# EAGLE design store-ctrl-block (EAGLE 7.3.0)
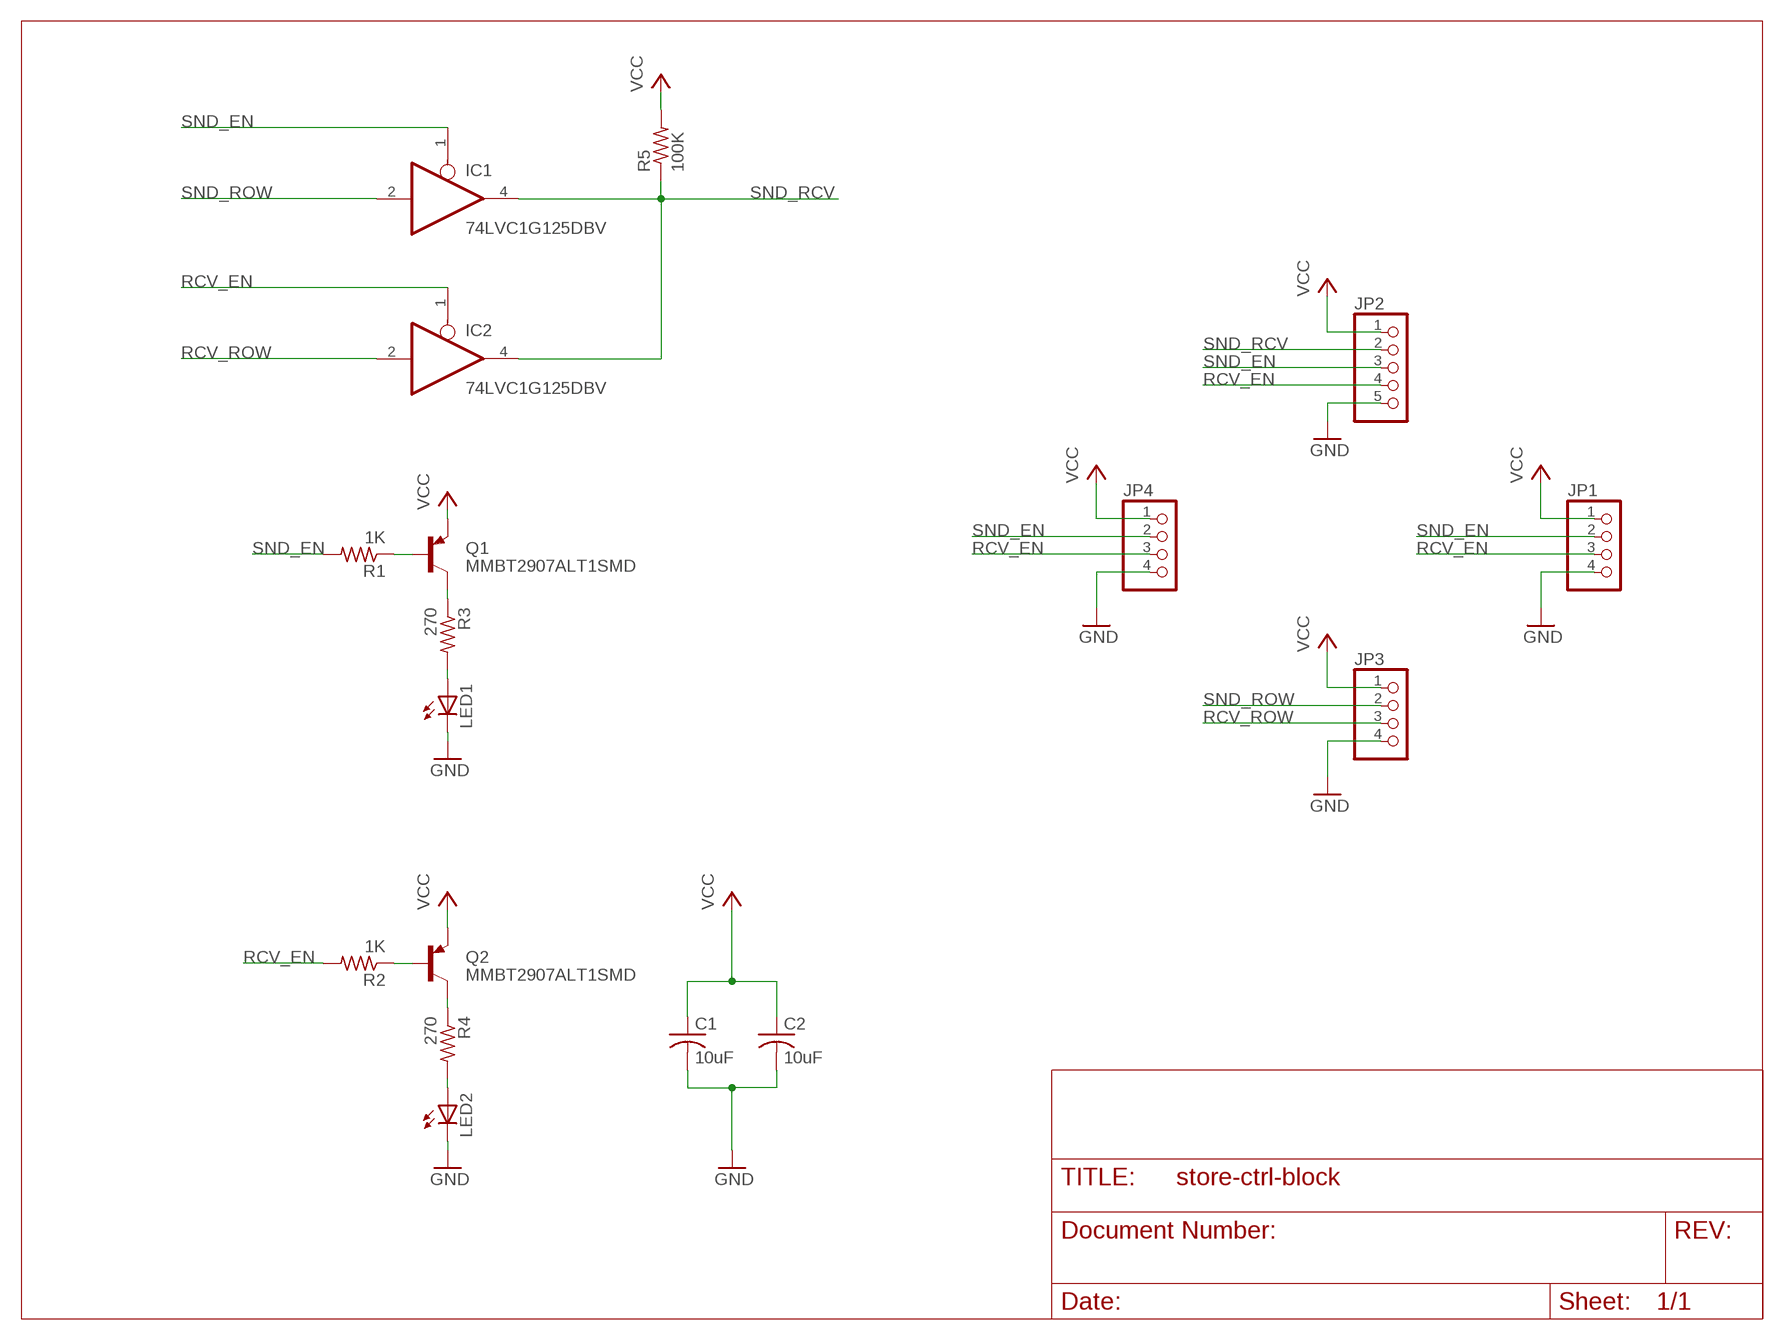
[diagram p0: schematic, sheet 1]

## Parts
C1  10uF  C-USC0805  [C0805]
C2  10uF  C-USC0805  [C0805]
IC1  74LVC1G125DBV  [SOT23-5]
IC2  74LVC1G125DBV  [SOT23-5]
JP1  PINHD-1X4  [1X04]
JP2  PINHD-1X5  [1X05]
JP3  PINHD-1X4  [1X04]
JP4  PINHD-1X4  [1X04]
LED1  LEDCHIP-LED0805  [CHIP-LED0805]
LED2  LEDCHIP-LED0805  [CHIP-LED0805]
Q1  MMBT2907ALT1SMD  [SOT23-BEC]
Q2  MMBT2907ALT1SMD  [SOT23-BEC]
R1  1K  R-US_R0805  [R0805]
R2  1K  R-US_R0805  [R0805]
R3  270  R-US_R0805  [R0805]
R4  270  R-US_R0805  [R0805]
R5  100K  R-US_R0805  [R0805]

## Nets
GND: C1.2 C2.2 JP1.4 JP2.5 JP3.4 JP4.4 LED1.C LED2.C
N$1: Q2.B R2.1
N$2: Q1.B R1.1
N$3: Q2.C R4.1
N$4: Q1.C R3.1
N$5: LED1.A R3.2
N$6: LED2.A R4.2
RCV_EN: IC2.1(OE) JP1.3 JP2.4 JP4.3 R2.2
RCV_ROW: IC2.2(I) JP3.3
SND_EN: IC1.1(OE) JP1.2 JP2.3 JP4.2 R1.2
SND_RCV: IC1.4(O) IC2.4(O) JP2.2 R5.1
SND_ROW: IC1.2(I) JP3.2
VCC: C1.1 C2.1 JP1.1 JP2.1 JP3.1 JP4.1 Q1.E Q2.E R5.2

## Power pins joined to a net without a drawn wire
GND: IC1.3(GND) IC2.3(GND)
VCC: IC1.5(VCC) IC2.5(VCC)

## Library data of the parts
C1 C2 = resistor:C-US: CAPACITOR, American symbol
IC1 IC2 = 74xx-little-us:74*1G125: Single Bus Buffer Gate with 3-State Output
JP1 JP3 JP4 = pinhead:PINHD-1X4: PIN HEADER
JP2 = pinhead:PINHD-1X5: PIN HEADER
LED1 LED2 = led:LED: LED OSRAM: - CHIPLED LG R971, LG N971, LY N971, LG Q971, LY Q971, LO R971, LY R971 LH N974, LH R974 LS Q976, LO Q976, LY Q976 LO Q996 - Hyper CHIPLED LW Q18S LB Q993, LB Q99A, LB R99A - SideLED LS A670, LO A670, LY A670, LG A670, LP A670 LB A673, LV A673, LT A673, LW A673 LH A674 LY A675 LS A676, LA A676, LO A676, LY A676, LW A676 LS A679, LY A679, LG A679 - Hyper Micro SIDELED® LS Y876, LA Y876, LO Y876, LY Y876 LT Y87S - SmartLED LW L88C, LW L88S LB L89C, LB L89S, LG L890 LS L89K, LO L89K, LY L89K LS L896, LA L896, LO L896, LY L896 - TOPLED LS T670, LO T670, LY T670, LG T670, LP T670 LSG T670, LSP T670, LSY T670, LOP T670, LYG T670 LG T671, LOG T671, LSG T671 LB T673, LV T673, LT T673, LW T673 LH T674 LS T676, LA T676, LO T676, LY T676, LB T676, LH T676, LSB T676, LW T676 LB T67C, LV T67C, LT T67C, LS T67K, LO T67K, LY T67K, LW E67C LS E67B, LA E67B, LO E67B, LY E67B, LB E67C, LV E67C, LT E67C LW T67C LS T679, LY T679, LG T679 LS T770, LO T770, LY T770, LG T770, LP T770 LB T773, LV T773, LT T773, LW T773 LH T774 LS E675, LA E675, LY E675, LS T675 LS T776, LA T776, LO T776, LY T776, LB T776 LHGB T686 LT T68C, LB T68C - Hyper Mini TOPLED® LB M676 - Mini TOPLED Santana® LG M470 LS M47K, LO M47K, LY M47K Source: http://www.osram.convergy.de LUXEON: - LUMILED® LXK2-PW12-R00, LXK2-PW12-S00, LXK2-PW14-U00, LXK2-PW14-V00 LXK2-PM12-R00, LXK2-PM12-S00, LXK2-PM14-U00 LXK2-PE12-Q00, LXK2-PE12-R00, LXK2-PE12-S00, LXK2-PE14-T00, LXK2-PE14-U00 LXK2-PB12-K00, LXK2-PB12-L00, LXK2-PB12-M00, LXK2-PB14-N00, LXK2-PB14-P00, LXK2-PB14-Q00 LXK2-PR12-L00, LXK2-PR12-M00, LXK2-PR14-Q00, LXK2-PR14-R00 LXK2-PD12-Q00, LXK2-PD12-R00, LXK2-PD12-S00 LXK2-PH12-R00, LXK2-PH12-S00 LXK2-PL12-P00, LXK2-PL12-Q00, LXK2-PL12-R00 Source: www.luxeon.com KINGBRIGHT: KA-3528ASYC Source: www.kingbright.com
Q1 Q2 = transistor-pnp:MMBT2907*: PNP Transistror
R1-R5 = resistor:R-US_: RESISTOR, American symbol

## Board
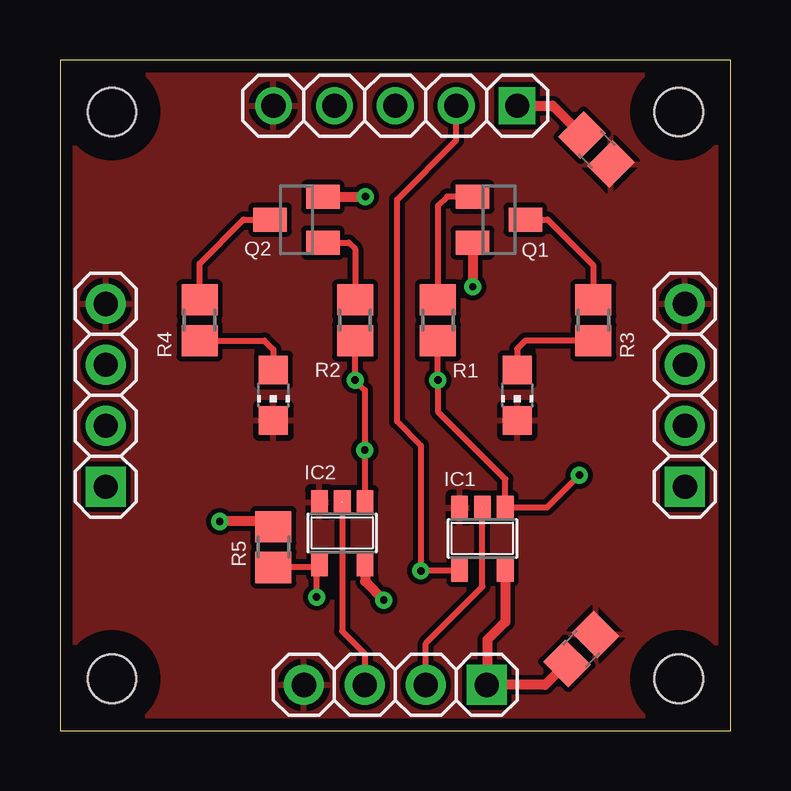
[diagram p1: board, top side]
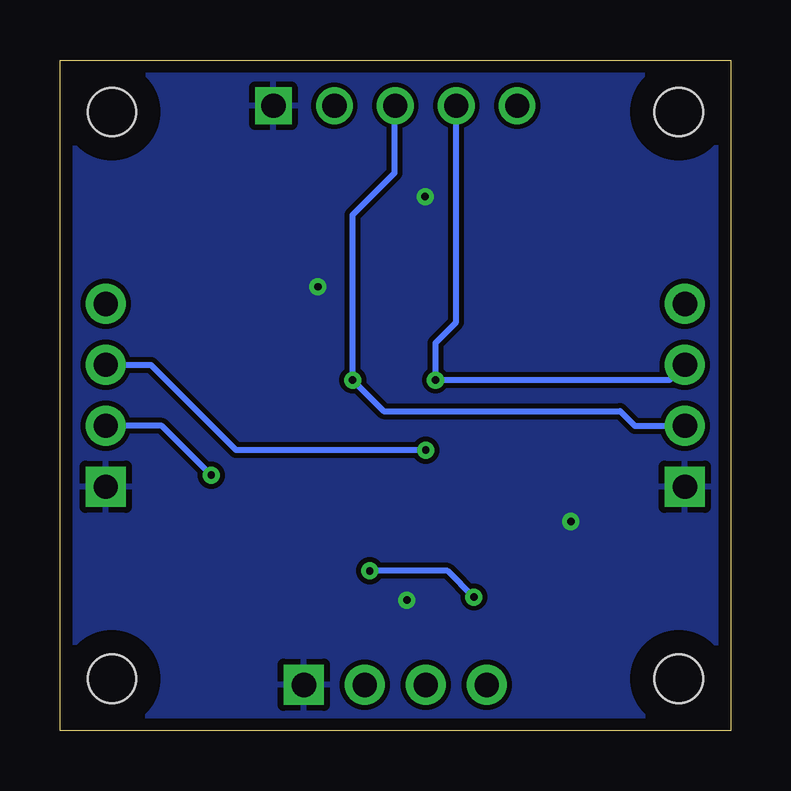
[diagram p2: board, bottom side, seen from below]

Size 27.94 x 27.94 mm. Coordinates in mm from the lower left corner, seen from the top.
Outline: 27.94,27.94 0,27.94 0,0 27.94,0 27.94,27.94
Copper layers (1*16): Top 0.035mm / dielectric 1.5mm / Bottom 0.035mm
Design rules "default *": minimum track width 8mil, minimum drill 12mil, track to track 8mil, track to pad 8mil, pad to pad 8mil, via to via 8mil, smd to smd 8mil, copper to edge 20mil, drill to drill 8mil, minimum pad ring 10mil, minimum via ring 8mil, stop-mask expansion 4mil, vias tented up to drill 0mil, thermal gap 10mil
Holes 2.01 mm at 2.16,2.16 25.78,2.16 25.78,25.78 2.16,25.78
tRestrict: area 23.8,0.2 to 27.8,4.2; area 23.8,23.8 to 27.8,27.8; area 0.2,23.8 to 4.2,27.8; area 0.2,0.2 to 4.2,4.2
bRestrict: area 23.8,0.2 to 27.8,4.2; area 23.8,23.8 to 27.8,27.8; area 0.2,23.8 to 4.2,27.8; area 0.2,0.2 to 4.2,4.2

### Footprints (pad centres in the part's own frame; a part is rotated, then mirrored left to right if it is on the bottom)
C0805 = smd 1.3 x 1.5: 1 -0.85,0; 2 0.85,0
SOT23-5 = smd 0.69 x 0.99: 1 -0.95,-1.29; 2 0,-1.29; 3 0.95,-1.29; 4 0.95,1.3; 5 -0.95,1.3
1X04 = drill 1.016 pad 1.676 square: 1 -3.81,0 | drill 1.016 pad 1.676: 2 -1.27,0; 3 1.27,0; 4 3.81,0
1X05 = drill 1.016 square: 1 -5.08,0 | drill 1.016: 2 -2.54,0; 3 0,0; 4 2.54,0; 5 5.08,0
CHIP-LED0805 = smd 1.2 x 1.2: A 0,-1.05; C 0,1.05
SOT23-BEC = smd 1 x 1.4: B -0.95,-1.1; C 0,1.1; E 0.95,-1.1
R0805 = smd 1.3 x 1.5: 1 -0.85,0; 2 0.85,0

### Placement (x,y rotation side)
C1  21.72,3.4 45 top
C2  22.35,24.21 315 top
IC1  17.6,8 180 top
IC2  11.76,8.23 180 top
JP1  26.04,13.97 90 top
JP2  13.97,26.04 180 top
JP3  13.97,1.91 180 top
JP4  1.91,13.97 90 top
LED1  19.05,13.97 180 top
LED2  8.89,13.97 180 top
Q1  18.29,21.29 270 top
Q2  9.86,21.29 90 top
R1  15.75,17.09 270 top
R2  12.29,17.09 270 top
R3  22.23,17.09 270 top
R4  5.82,17.09 270 top
R5  8.89,7.65 90 top

### Tracks (layer width: path | path; a pad name or v marks a point on that pad's centre or on a via)
GND
  pour Top: 27.69,0.25 0.25,0.25 0.25,27.69 27.69,27.69
N$1
  Top 0.254: Q2.B 12.02,20.34 12.29,20.07 R2.1
N$2
  Top 0.254: Q1.B 17.17,22.25 16.13,22.25 15.75,21.87 R1.1
N$3
  Top 0.254: R4.1 5.82,19.46 7.64,21.29 Q2.C
N$4
  Top 0.254: Q1.C 20.32,21.29 22.23,19.38 R3.1
N$5
  Top 0.254: R3.2 19.39,16.24 19.05,15.9 LED1.A
N$6
  Top 0.254: R4.2 8.52,16.24 8.89,15.88 LED2.A
RCV_EN  (via drill 0.3)
  Top 0.254: 12.81,9.42 IC2.1 v12.7,11.68 12.7,14.19 12.29,14.6 v12.29,14.61 R2.2
  Bottom 0.254: JP1.3 24.16,15.24 20.6,11.68 v12.7,11.68 | JP4.3 2.54,14.61 v12.29,14.61 12.29,16.15 11.43,17.02 JP2.4
RCV_ROW
  Top 0.254: IC2.2 11.76,4.14 12.7,3.2 JP3.3
SND_EN  (via drill 0.3)
  Top 0.254: v21.64,10.64 20.29,9.29 IC1.1 18.55,10.48 15.75,13.28 v15.75,14.61 R1.2
  Bottom 0.254: v21.64,10.64 23.7,12.7 JP1.2 | JP4.2 3.99,12.7 4.6,13.31 14.45,13.31 v15.75,14.61 15.75,21.49 13.99,23.24 13.99,26.01 JP2.3
SND_RCV  (via drill 0.3)
  Top 0.254: v10.69,5.56 10.69,6.81 | 10.69,6.81 IC2.4 | 10.69,6.81 10.68,6.79 R5.1 | IC1.4 16.61,6.66 v15.04,6.66 15.04,11.89 14.05,12.88 14.05,22.12 16.51,24.59 JP2.2
  Bottom 0.254: v10.69,5.56 11.79,6.66 v15.04,6.66
SND_ROW
  Top 0.254: JP3.2 15.24,3.63 17.6,5.99 IC1.2
VCC  (via drill 0.3)
  Top 0.406: IC1.5 18.55,4.53 17.8,3.79 17.8,1.93 JP3.1 20.22,1.91 C1.1 | Q1.E 17.2,20.33 v17.2,18.49 | R5.2 8.89,8.71 v6.66,8.71 | Q2.E v12.72,22.25 | IC2.5 12.71,6.21 v13.49,5.44 | JP2.1 20.52,26.04 C2.1
  pour Bottom: 0.25,0.25 27.69,0.25 27.69,27.69 0.25,27.69

### Text on the board
Document: RCV | SND | SND/RCV / CONTROL